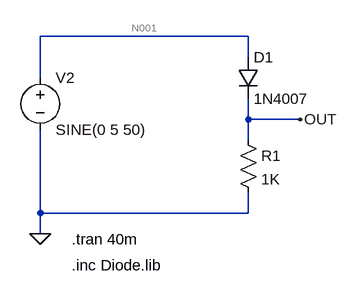
[diagram p0: schematic Diode_1N4007.asc]
Diode_1N4007.asc, the LTspice schematic file:
Version 4.1
SHEET 1 880 680
WIRE -432 64 -752 64
WIRE -432 96 -432 64
WIRE -752 128 -752 64
WIRE -432 192 -432 160
WIRE -352 192 -432 192
WIRE -432 224 -432 192
WIRE -752 336 -752 208
WIRE -432 336 -432 304
WIRE -432 336 -752 336
WIRE -752 368 -752 336
FLAG -752 368 0
FLAG -352 192 OUT
SYMBOL voltage -752 112 R0
WINDOW 123 0 0 Left 0
WINDOW 39 0 0 Left 0
SYMATTR InstName V2
SYMATTR Value SINE(0 5 50)
SYMBOL res -448 208 R0
SYMATTR InstName R1
SYMATTR Value 1K
SYMBOL diode -448 96 R0
SYMATTR InstName D1
SYMATTR Value 1N4007
TEXT -704 376 Left 2 !.tran 40m
TEXT -704 416 Left 2 !.inc Diode.lib

The netlist it stands for:
* Diode_1N4007.asc
V2 N001 0 SINE(0 5 50)
R1 OUT 0 1K
D1 N001 OUT 1N4007
.model D D
.lib standard.dio
.tran 40m
.inc Diode.lib
.backanno
.end

* Results of the author's LTspice run, read from the files saved beside the schematic
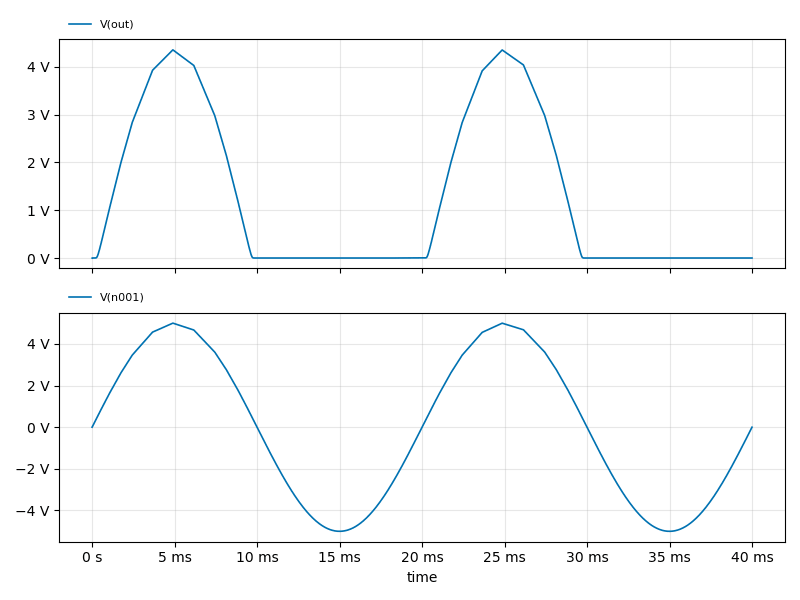
[diagram p1: Transient Analysis of Diode_1N4007.asc, plotted from the saved traces]
* Transient Analysis, 1 run:
*   V(out): min -75.95 µV, max 4.356 V, average 1.28 V, rms 2.09 V, last 36.2 µV
*   V(n001): min -5 V, max 4.997 V, average -16.1 mV, rms 3.523 V, last 0 V